# EAGLE design Alarm and Security System (EAGLE 9.6.2)
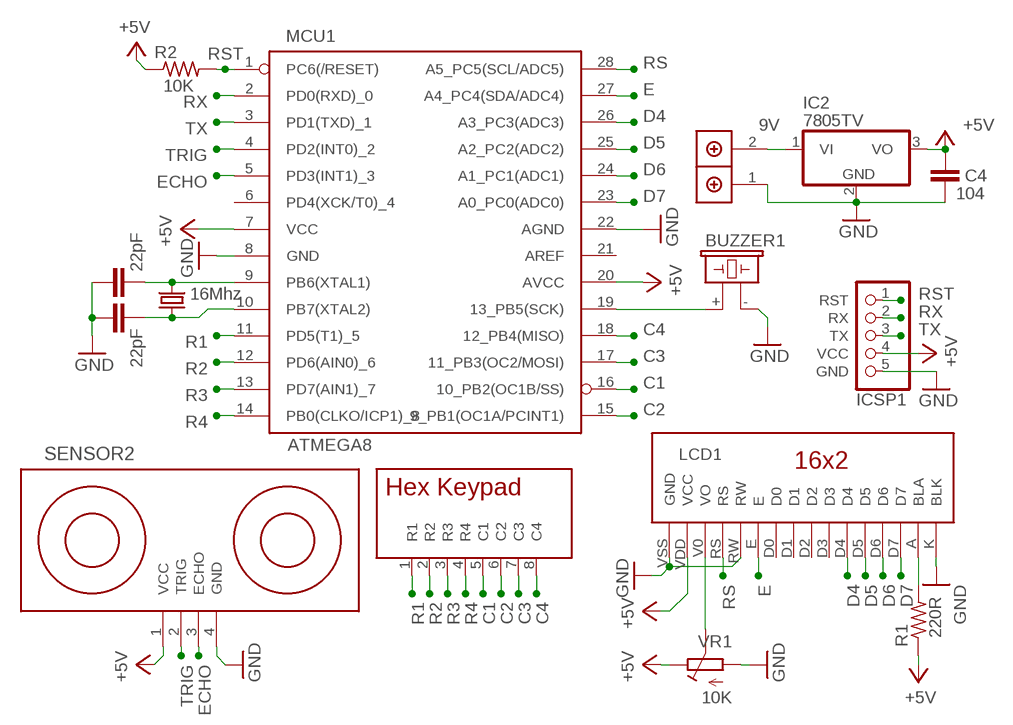
[diagram p0: schematic, sheet 1]

## Parts
BUZZER1  F/CM12P  [F/CM12P]
C1  22pF  22PF  [22PF]
C2  22pF  22PF  [22PF]
C4  104  [104]
IC2  7805TV  [TO220V]
ICSP1  ICSP_ATMEGA328  [ICSP_ATMEGA]
KEYPAD1  HEX_KEYPAD  [HEX_KEYPAD]
LCD1  16X2_LCD  [16X2_LCD]
MCU1  ATMEGA8  ATMEGA328_P  [ATMEGA328_P]
Q1  16Mhz  CRYSTAL  [CRYSTAL]
R1  220R  RES204/7  [THR_R_204/7]
R2  10K  RES204/7  [THR_R_204/7]
SENSOR2  ULTRASONIC-HC-SR04SONAR  [1X04]
TB2  2P  [2P]
VR1  10K  BLUE_VR  [BLUE_VR]

## Nets
9V: IC2.1(VI) TB2.2(CONN2)
+5V: C4.1 IC2.3(VO) ICSP1.4(VCC) LCD1.VDD(VCC) MCU1.7(VCC) MCU1.20(AVCC) R1.1 R2.1 SENSOR2.1(VCC) VR1.1
C1: KEYPAD1.5(C1) MCU1.16(10_PB2(OC1B/SS))
C2: KEYPAD1.6(C2) MCU1.15(9_PB1(OC1A/PCINT1))
C3: KEYPAD1.7(C3) MCU1.17(11_PB3(OC2/MOSI))
C4: KEYPAD1.8(C4) MCU1.18(12_PB4(MISO))
D4: LCD1.D4 MCU1.26(A3_PC3(ADC3))
D5: LCD1.D5 MCU1.25(A2_PC2(ADC2))
D6: LCD1.D6 MCU1.24(A1_PC1(ADC1))
D7: LCD1.D7 MCU1.23(A0_PC0(ADC0))
E: LCD1.E MCU1.27(A4_PC4(SDA/ADC4))
ECHO: MCU1.5(PD3(INT1)_3) SENSOR2.3(ECHO)
GND: BUZZER1.- C1.1 C2.2 C4.2 IC2.2(GND) ICSP1.5(GND) LCD1.K(BLK) LCD1.RW LCD1.VSS(GND) MCU1.8(GND) MCU1.22(AGND) SENSOR2.4(GND) TB2.1(CONN1) VR1.3
N$1: C1.2 MCU1.9(PB6(XTAL1)) Q1.2
N$2: C2.1 MCU1.10(PB7(XTAL2)) Q1.1
N$3: LCD1.A(BLA) R1.2
N$4: LCD1.V0(VO) VR1.2
N$5: BUZZER1.+ MCU1.19(13_PB5(SCK))
R1: KEYPAD1.1(R1) MCU1.11(PD5(T1)_5)
R2: KEYPAD1.2(R2) MCU1.12(PD6(AIN0)_6)
R3: KEYPAD1.3(R3) MCU1.13(PD7(AIN1)_7)
R4: KEYPAD1.4(R4) MCU1.14(PB0(CLKO/ICP1)_8)
RS: LCD1.RS MCU1.28(A5_PC5(SCL/ADC5))
RST: ICSP1.1(RST) MCU1.1(PC6(/RESET)) R2.2
RX: ICSP1.2(RX) MCU1.2(PD0(RXD)_0)
TRIG: MCU1.4(PD2(INT0)_2) SENSOR2.2(TRIG)
TX: ICSP1.3(TX) MCU1.3(PD1(TXD)_1)
Unconnected: LCD1.D0 LCD1.D1 LCD1.D2 LCD1.D3 MCU1.6(PD4(XCK/T0)_4) MCU1.21(AREF)

## Library data of the parts
BUZZER1 = MHN_Buzzer:F/CM12P: BUZZER Source: Buerklin; OC_FARNELL: unknown; OC_NEWARK: unknown
C1 C2 = MHN_Capacitor:22PF: (220)22pf Ceramic Capacitor
C4 = MHN_Capacitor:104: Ciramic Capacitor - 104/103/22/33 pf
IC2 = linear:78*: Positive VOLTAGE REGULATOR Source: http://cache.national.com/ds/LM/LM78L05.pdf http://www.fairchildsemi.com/ds/LM/LM7805.pdf
ICSP1 = MHN_ICSP_Header:ICSP_ATMEGA328
KEYPAD1 = MHN_Keypad:HEX_KEYPAD: Hex Keypad
LCD1 = MHN_Display:16X2_LCD: 16*2 LCD Display
MCU1 = MHN_IC_Microcontroller:ATMEGA328_P: Microcontroller with 32K Bytes In-System Programmable Flash
Q1 = MHN_Crystal:CRYSTAL: CRYSTAL
R1 R2 = MHN_Resistor:RES
SENSOR2 = MHN_Modules:ULTRASONIC-HC-SR04: Ultrasonic Ranging Module HC-SR04 More details available here: http://randomnerdtutorials.com/complete-guide-for-ultrasonic-sensor-hc-sr04/ Click here to find device on ebay.com <http://www.ebay.com/sch/hc+sr04+ultrasonic>
TB2 = MHN_TBlock:2P: Green Terminal Block
VR1 = MHN_VR:BLUE_VR

## Board
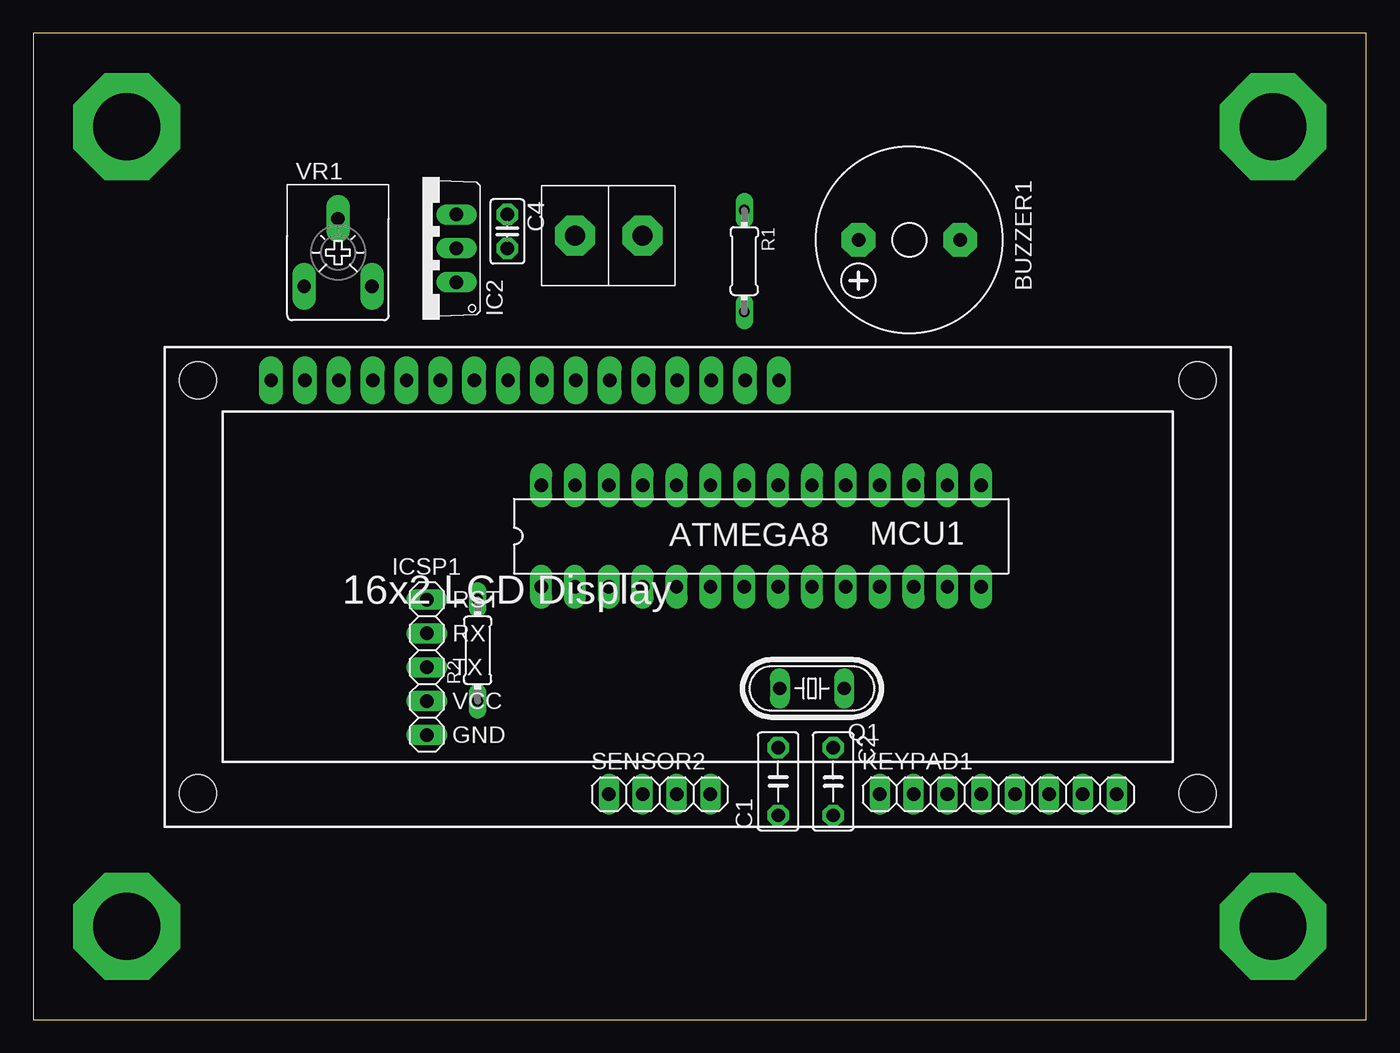
[diagram p1: board, top side]
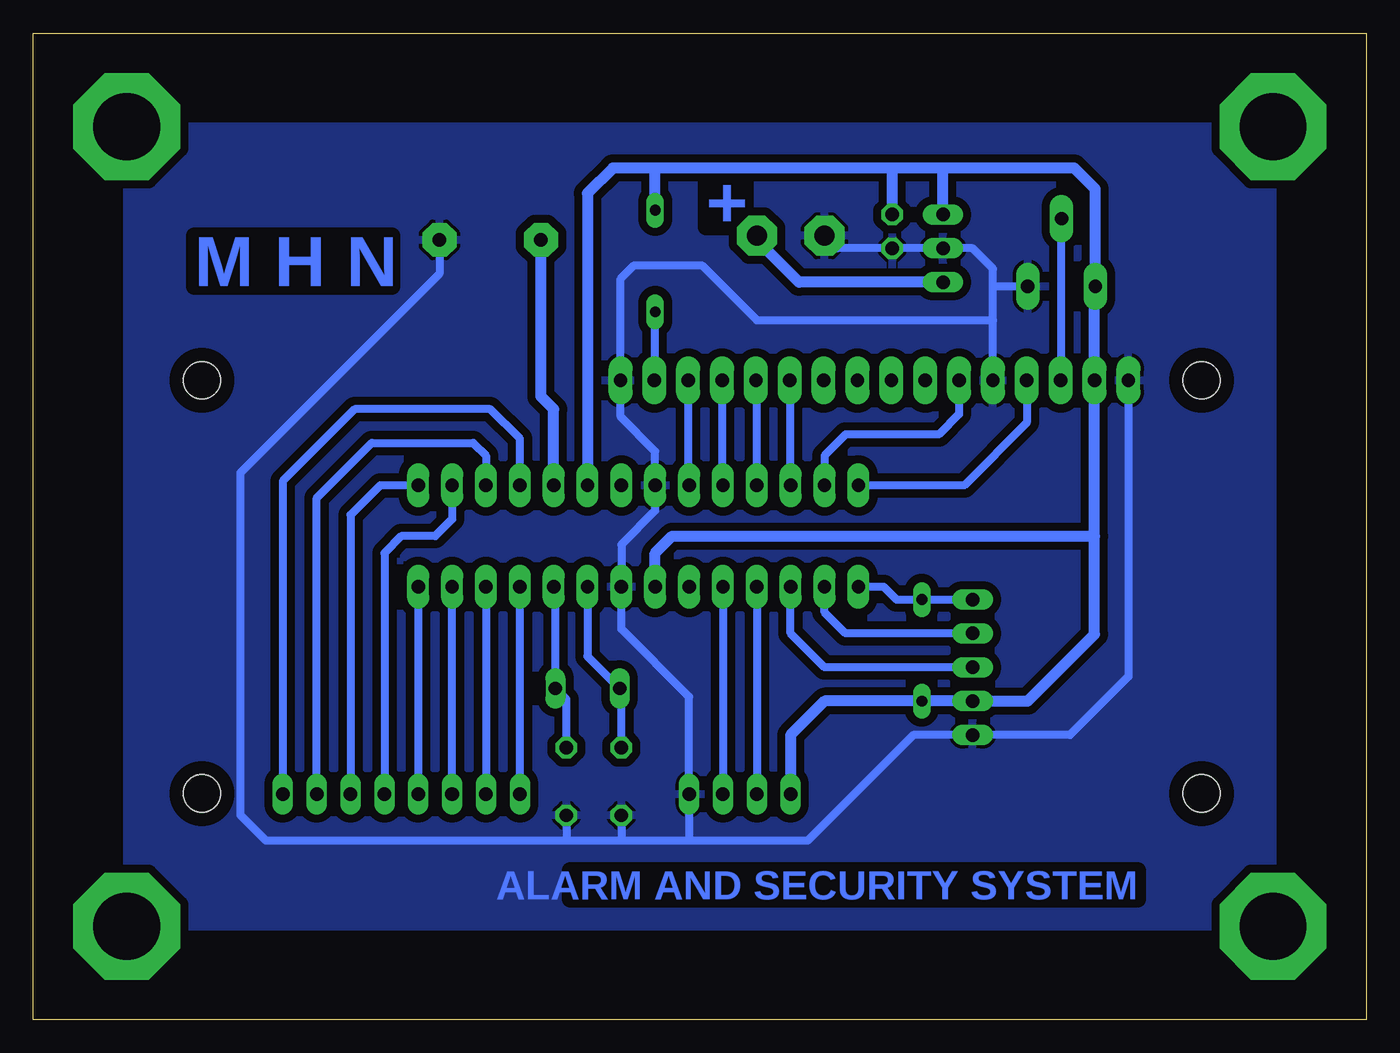
[diagram p2: board, bottom side, seen from below]

Size 100 x 74 mm. Coordinates in mm from the lower left corner, seen from the top.
Outline: 0,0 100,0 100,74 0,74 0,0
Copper layers (1*16): Top 0.035mm / dielectric 1.5mm / Bottom 0.035mm
Design rules "default": minimum track width 6mil, minimum drill 0.35mm, track to track 6mil, track to pad 6mil, pad to pad 6mil, via to via 6mil, smd to smd 6mil, copper to edge 40mil, drill to drill 6mil, minimum pad ring 10mil, minimum via ring 8mil, stop-mask expansion 4mil, vias tented up to drill 0mil, thermal gap 10mil

### Footprints (pad centres in the part's own frame; a part is rotated, then mirrored left to right if it is on the bottom)
F/CM12P = drill 1.016 pad 2.54 octagon: + 3.81,0; - -3.81,0
22PF = drill 1 pad 1.6 octagon: 1 -2.54,0; 2 2.54,0
104 = drill 1 pad 1.6 octagon: 1 -1.27,0; 2 1.27,0
TO220V = drill 1.016 long: 1 -2.54,-2.54; 2 0,-2.54; 3 2.54,-2.54
ICSP_ATMEGA = drill 1.016 long: 1 -5.08,0; 2 -2.54,0; 3 0,0; 4 2.54,0; 5 5.08,0
HEX_KEYPAD = drill 1.016 long: 1 -8.89,0; 2 -6.35,0; 3 -3.81,0; 4 -1.27,0; 5 1.27,0; 6 3.81,0; 7 6.35,0; 8 8.89,0
16X2_LCD = drill 1 pad 1.8 long: A 3.556,15.494; D0 -16.764,15.494; D1 -14.224,15.494; D2 -11.684,15.494; D3 -9.144,15.494; D4 -6.604,15.494; D5 -4.064,15.494; D6 -1.524,15.494; D7 1.016,15.494; E -19.304,15.494; K 6.096,15.494; RS -24.384,15.494; RW -21.844,15.494; V0 -26.924,15.494; VDD -29.46,15.5; VSS -32.004,15.494 | hole 2.8: -37.5,15.5; -37.5,-15.5; 37.5,15.5; 37.5,-15.5
ATMEGA328_P = drill 1 pad 1.65 long: 1 -7.62,-3.81; 2 -5.08,-3.81; 3 -2.54,-3.81; 4 0,-3.81; 5 2.54,-3.81; 6 5.08,-3.81; 7 7.62,-3.81; 8 10.16,-3.81; 9 12.7,-3.81; 10 15.24,-3.81; 11 17.78,-3.81; 12 20.32,-3.81; 13 22.86,-3.81; 14 25.4,-3.81; 15 25.4,3.81; 16 22.86,3.81; 17 20.32,3.81; 18 17.78,3.81; 19 15.24,3.81; 20 12.7,3.81; 21 10.16,3.81; 22 7.62,3.81; 23 5.08,3.81; 24 2.54,3.81; 25 0,3.81; 26 -2.54,3.81; 27 -5.08,3.81; 28 -7.62,3.81
CRYSTAL = drill 1 pad 1.5 long: 1 -2.413,0; 2 2.413,0
THR_R_204/7 = drill 0.813 long: 1 -3.81,0; 2 3.81,0
1X04 = drill 1.016 long: 1 -3.81,0; 2 -1.27,0; 3 1.27,0; 4 3.81,0
2P = drill 1.5 pad 3 octagon: 1 -2.54,0; 2 2.54,0
BLUE_VR = drill 1 pad 1.778 long: 1 -2.54,-2.54; 2 0,2.54; 3 2.54,-2.54

### Placement (x,y rotation side)
BUZZER1  65.72,58.5 180 top
C1  55.88,17.86 90 top
C2  60.01,17.86 270 top
C4  35.56,59.14 270 top
IC2  29.21,57.87 90 top
ICSP1  29.53,26.43 270 top
KEYPAD1  72.39,16.91 0 top
LCD1  49.85,32.47 0 top
MCU1  45.72,36.27 0 top
Q1  58.42,24.84 180 top
R1  53.34,56.91 270 top
R2  33.34,27.7 90 top
SENSOR2  46.99,16.91 0 top
TB2  43.18,58.82 0 top
VR1  22.86,57.55 0 top

### Tracks (layer width: path | path; a pad name or v marks a point on that pad's centre or on a via)
9V
  Bottom 0.813: IC2.1 42.55,55.33 45.72,58.5 TB2.2
+5V
  Bottom 0.813: MCU1.20 58.42,61.99 56.52,63.9 53.34,63.9 | MCU1.7 53.34,35.01 52.07,36.27 20.39,36.27 | 31.75,63.9 21.91,63.9 20.32,62.31 VR1.1 20.39,54.94 LCD1.VDD 20.39,36.27 | 31.75,63.9 35.56,63.9 | 35.56,63.9 53.34,63.9 | IC2.3 31.75,63.9 | C4.1 35.56,63.9 | R1.1 53.34,63.9 | 20.39,36.27 20.39,28.91 25.4,23.89 ICSP1.4 R2.1 40.64,23.89 43.18,21.35 SENSOR2.1
C1
  Bottom 0.61: MCU1.16 68.58,37.55 69.85,36.27 72.39,36.27 73.66,35.01 KEYPAD1.5
C2
  Bottom 0.61: MCU1.15 73.98,40.09 76.2,37.86 KEYPAD1.6
C3
  Bottom 0.61: KEYPAD1.7 78.74,39.13 74.61,43.26 66.99,43.26 66.04,42.31 MCU1.17
C4
  Bottom 0.61: MCU1.18 63.5,43.58 65.72,45.8 75.88,45.8 81.28,40.4 KEYPAD1.8
D4
  Bottom 0.61: LCD1.D4 43.24,40.15 MCU1.26
D5
  Bottom 0.61: MCU1.25 45.72,47.9 LCD1.D5
D6
  Bottom 0.61: LCD1.D6 48.32,40.15 MCU1.24
D7
  Bottom 0.61: LCD1.D7 50.86,40.15 MCU1.23
E
  Bottom 0.61: LCD1.E 30.54,45.42 32.07,43.9 39.05,43.9 40.64,42.31 MCU1.27
ECHO
  Bottom 0.61: MCU1.5 SENSOR2.3
GND
  Bottom 0.61: LCD1.RW 28,52.47 | 28,52.47 28,55.01 | 28,55.01 28,56.34 29.53,57.87 IC2.2 C4.2 39.69,57.87 TB2.1 | VR1.3 28,55.01 | 28,52.47 45.72,52.47 49.85,56.59 54.93,56.59 55.94,55.58 LCD1.K 55.94,45.23 53.34,42.62 MCU1.22 53.34,38.18 55.88,35.64 MCU1.8 55.88,29.29 50.8,24.21 SENSOR2.4 50.8,13.41 | BUZZER1.- 69.53,55.96 84.45,41.04 84.45,15.32 82.55,13.41 60.01,13.41 | 50.8,13.41 55.88,13.41 | 55.88,13.41 60.01,13.41 | C1.1 55.88,13.41 | C2.2 60.01,13.41 | 50.8,13.41 41.91,13.41 33.97,21.35 ICSP1.5 22.23,21.35 17.84,25.73 LCD1.VSS
  pour Bottom (isolate 0.61): 7,67 93,67 93,7 7,7
N$1
  Bottom 0.61: MCU1.9 58.42,27.26 Q1.2 55.88,24.72 C1.2
N$2
  Bottom 0.61: MCU1.10 60.83,32.34 Q1.1 60.01,24.02 C2.1
N$3
  Bottom 0.61: R1.2 53.4,53.04 LCD1.A
N$4
  Bottom 0.61: LCD1.V0 22.86,48.02 VR1.2
N$5
  Bottom 0.813: MCU1.19 60.96,45.8 61.91,46.75 BUZZER1.+
N$6  (via drill 5 pad 8)
  other vias: 93,67
N$7  (via drill 5 pad 8)
  other vias: 7,7
N$8  (via drill 5 pad 8)
  other vias: 7,67
N$9  (via drill 5 pad 8)
  other vias: 93,7
R1
  Bottom 0.61: KEYPAD1.1 MCU1.11
R2
  Bottom 0.61: MCU1.12 KEYPAD1.2
R3
  Bottom 0.61: KEYPAD1.3 MCU1.13
R4
  Bottom 0.61: MCU1.14 KEYPAD1.4
RS
  Bottom 0.61: LCD1.RS 25.46,44.78 30.16,40.09 MCU1.28
RST
  Bottom 0.61: ICSP1.1 R2.2 35.24,31.51 36.2,32.47 MCU1.1
RX
  Bottom 0.61: ICSP1.2 39.05,28.97 40.64,30.56 MCU1.2
TRIG
  Bottom 0.61: MCU1.4 SENSOR2.2
TX
  Bottom 0.61: ICSP1.3 40.64,26.43 43.18,28.97 MCU1.3

### Text on the board
Bottom: + | M H N | ALARM AND SECURITY SYSTEM